# EAGLE schematic tiny-door-and-window-sensor_v03 (EAGLE 7.6.0)
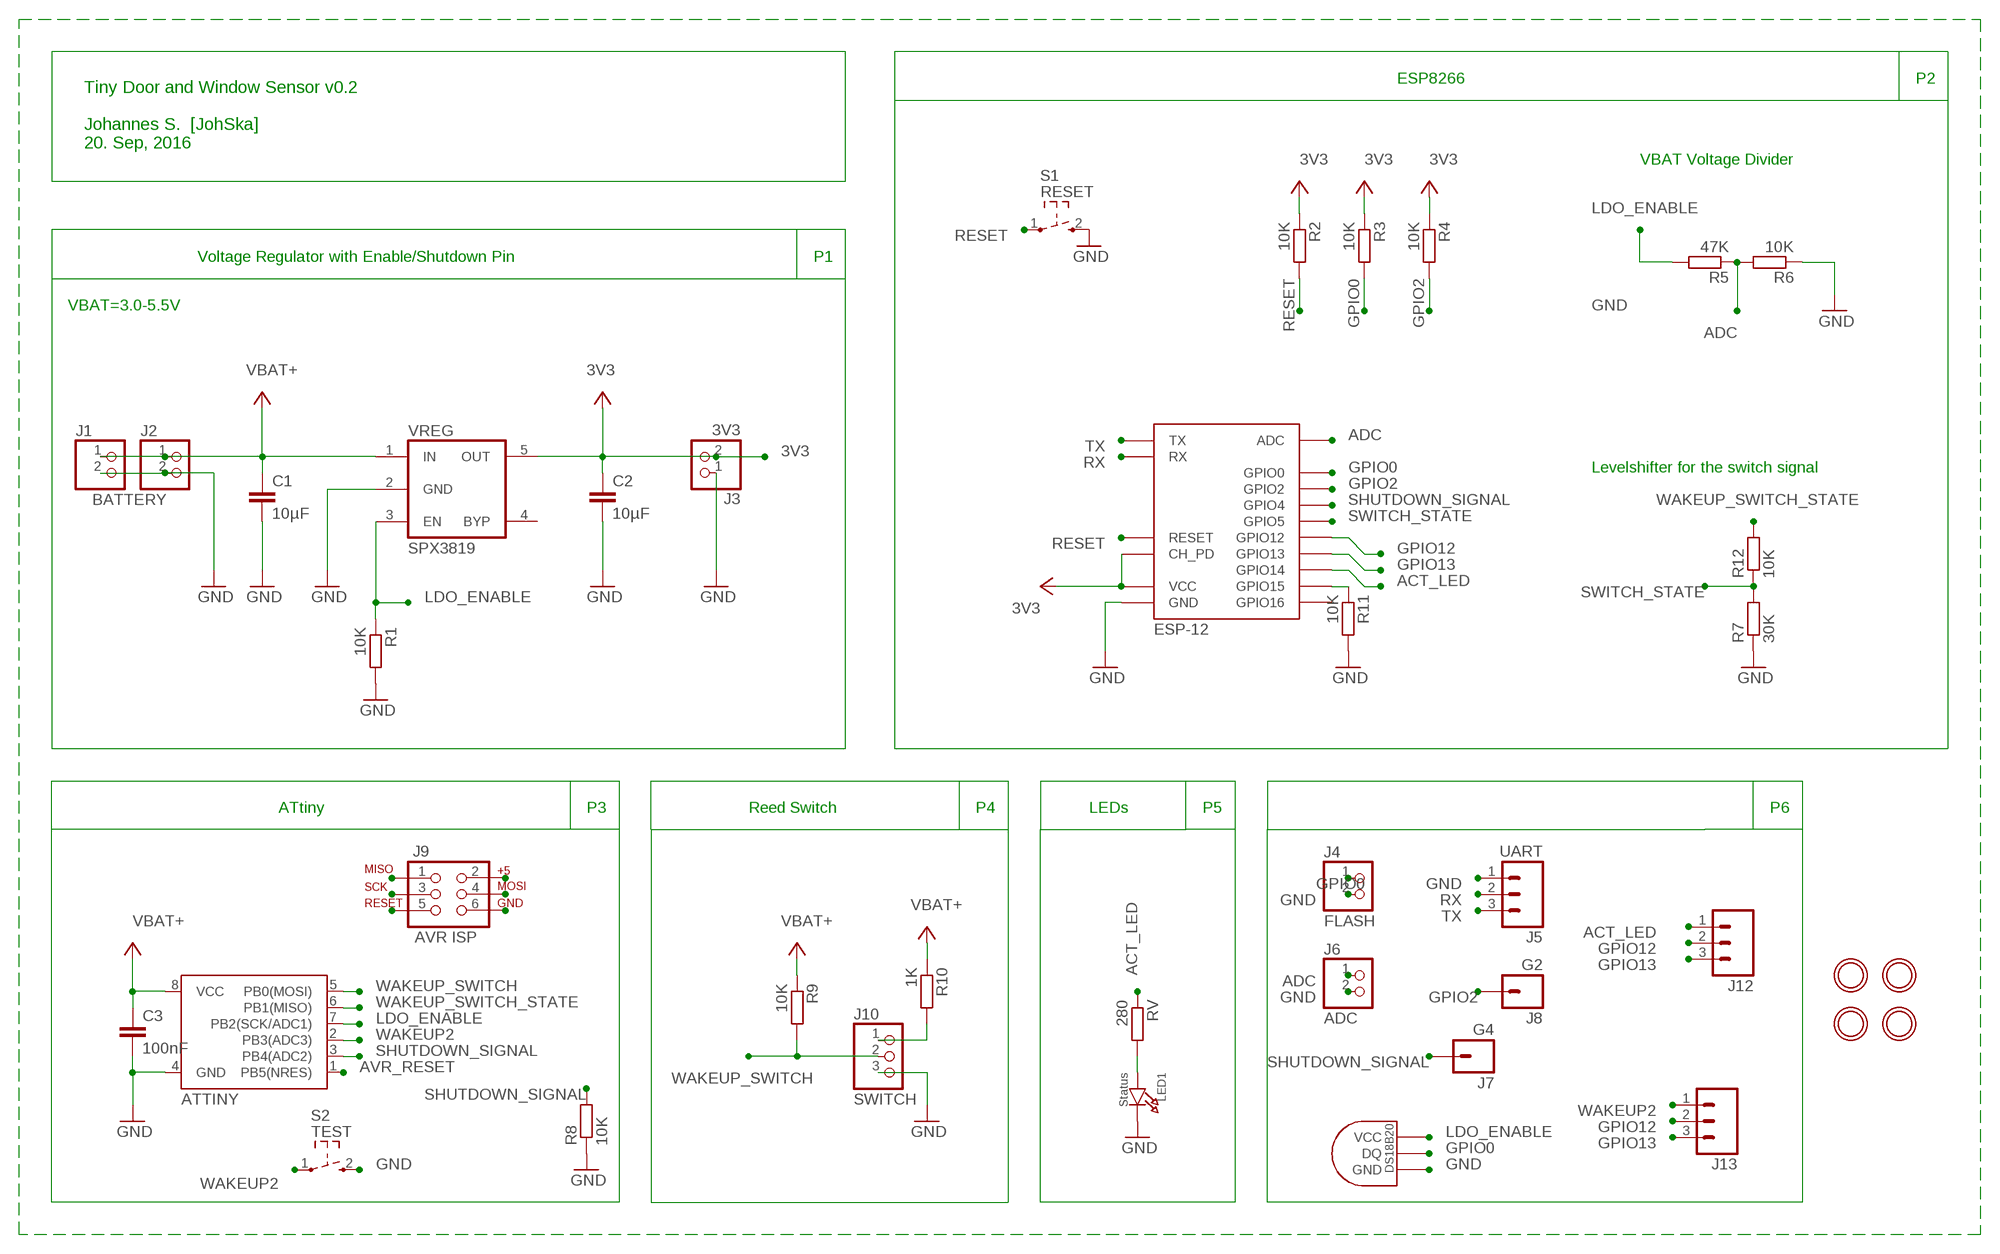
[diagram p0: schematic, sheet 1]

## Parts
C1  10µF  C-EUC0805  [C0805]
C2  10µF  C-EUC0805  [C0805]
C3  100nF  C-EUC0805  [C0805]
J1  BATTERY  HEADER-1X2  [1X02_OVAL]
J2  BATTERY  HEADER-1X2  [1X02_OVAL]
J3  3V3  HEADER-1X2ROUND  [1X02_ROUND]
J4  FLASH  HEADER-1X2ROUND  [1X02_ROUND]
J5  UART  M031X03_NO_SILK  [1X03_NO_SILK]
J6  ADC  HEADER-1X2ROUND  [1X02_ROUND]
J7  G4  M01SMDNS  [1X01NS]
J8  G2  M01SMDNS  [1X01NS]
J9  AVR ISP  AVR_SPI_PRG_6PTH  [2X3]
J10  SWITCH  PINHD-1X3  [1X03]
J12  M031X03_NO_SILK  [1X03_NO_SILK]
J13  M031X03_NO_SILK  [1X03_NO_SILK]
LED1  Status  LED1206  [CHIPLED_1206]
R1  10K  R-EU_R0805  [R0805]
R2  10K  R-EU_R0805  [R0805]
R3  10K  R-EU_R0805  [R0805]
R4  10K  R-EU_R0805  [R0805]
R5  47K  R-EU_R0805  [R0805]
R6  10K  R-EU_R0805  [R0805]
R7  30K  R-EU_R0805  [R0805]
R8  10K  R-EU_R0805  [R0805]
R9  10K  R-EU_R0805  [R0805]
R10  1K  R-EU_R0805  [R0805]
R11  10K  R-EU_R0805  [R0805]
R12  10K  R-EU_R0805  [R0805]
RV  280  R-EU_R0805  [R0805]
S1  RESET  SW_TACT_2P-3X6  [SW_TACT_3X6]
S2  TEST  SW_TACT_2P-3X6  [SW_TACT_3X6]
U$1  DS1820TO92  [DS1820]
U$2  ATTINY  ATTINY45  [SO08-EIAJ]
U$3  ESP-12  [ESP-12]
U$4  MOUNTINGHOLE2.5_THICK  [MOUNTINGHOLE_2.5_PLATED_THICK]
U$5  MOUNTINGHOLE2.5_THICK  [MOUNTINGHOLE_2.5_PLATED_THICK]
U$6  MOUNTINGHOLE2.5_THICK  [MOUNTINGHOLE_2.5_PLATED_THICK]
U$7  MOUNTINGHOLE2.5_THICK  [MOUNTINGHOLE_2.5_PLATED_THICK]
VREG  SPX3819  VREG_5PINS-SOT-23-5  [SOT-23-5]

## Nets
3V3: C2.1 J3.2 R2.1 R3.1 R4.1 U$3.CH_PD U$3.VCC VREG.5(OUT) ; supply symbol labelled VCC
ACT_LED: J12.1 RV.1 U$3.GPIO14
ADC: J6.1 R5.1 R6.2 U$3.ADC
AVR_RESET: J9.5 U$2.1(PB5(NRES))
GND: C1.2 C2.2 C3.2 J1.2 J2.2 J3.1 J4.2 J5.1 J6.2 J9.6 J10.3 LED1.C R1.2 R6.1 R7.1 R8.1 R11.2 S1.2 S2.2 U$1.GND U$2.4(GND) U$3.GND VREG.2(GND)
GPIO0: J4.1 R3.2 U$1.DQ U$3.GPIO0
GPIO2: J8.1 R4.2 U$3.GPIO2
GPIO12: J12.2 J13.2 U$3.GPIO12
GPIO13: J12.3 J13.3 U$3.GPIO13
LDO_ENABLE: J9.3 R1.1 R5.2 U$1.VDD(VCC) U$2.7(PB2(SCK/ADC1)) VREG.3(EN)
N$4: R11.1 U$3.GPIO15
N$8: LED1.A RV.2
RESET: R2.2 S1.1 U$3.RESET
RX: J5.2 U$3.RX
SHUTDOWN_SIGNAL: J7.1 R8.2 U$2.3(PB4(ADC2)) U$3.GPIO4
SWITCH_STATE: R7.2 R12.1 U$3.GPIO5
TX: J5.3 U$3.TX
VBAT+: C1.1 C3.1 J1.1 J2.1 J9.2 R9.1 R10.1 U$2.8(VCC) VREG.1(IN) ; supply symbol labelled VCC
VBAT+_R: J10.1 R10.2
WAKEUP2: J13.1 S2.1 U$2.2(PB3(ADC3))
WAKEUP_SWITCH: J9.4 J10.2 R9.2 U$2.5(PB0(MOSI))
WAKEUP_SWITCH_STATE: J9.1 R12.2 U$2.6(PB1(MISO))
Unconnected: U$3.GPIO16 VREG.4(BYP)

## Notes on the sheet
- ESP8266 | P2
- Tiny Door and Window Sensor v0.2
  
  Johannes S.  [JohSka]
  20. Sep, 2016
- VBAT Voltage Divider
- Voltage Regulator with Enable/Shutdown Pin | P1
- VBAT=3.0-5.5V
- Levelshifter for the switch signal
- ATtiny | P3 | Reed Switch | P4 | LEDs | P5 | P6

## Library data of the parts
C1-C3 = resistor:C-EU: CAPACITOR, European symbol
J1-J4 J6 = microbuilder:HEADER-1X2: PIN HEADER
J5 J12 J13 = SparkFun:M03: Header 3 Standard 3-pin 0.1" header. Use with straight break away headers (SKU : PRT-00116), right angle break away headers (PRT-00553), swiss pins (PRT-00743), machine pins (PRT-00117), and female headers (PRT-00115). Molex polarized connector foot print use with SKU : PRT-08232 with associated crimp pins and housings.
J7 J8 = SparkFun:M01: Header 1 Standard 1-pin 0.1" header. Use with straight break away headers (SKU : PRT-00116), right angle break away headers (PRT-00553), swiss pins (PRT-00743), machine pins (PRT-00117), and female headers (PRT-00115).
J9 = SparkFun:AVR_SPI_PRG_6: AVR ISP 6 Pin This is the reduced ISP connector for AVR programming. Common on Arduino. This footprint will take up less PCB space and can be used with a 10-pin to 6-pin adapter such as SKU: BOB-08508
J10 = pinhead:PINHD-1X3: PIN HEADER
LED1 = microbuilder:LED: LED 0603 - 0603 Surface Mount Package 2mA: Green LED - Low Power (3.9mcd, 2ma, 1.7Vf) - Digikey: 475-2709-2-ND Orange LED - Low Power (9.8mcd, 2ma, 1.8Vf) - Digikey: 475-1194-2-ND Red LED - Low Power (5mcd, 2ma, 1.8Vf) - Digikey: 475-1195-2-ND Yellow LED - Low Power (7mcd, 2ma, 1.8Vf) - Digikey: 475-1196-2-ND 5mA: Blue LED - Low Power (17mcd, 5ma, 2.9Vf) - Digikey: LNJ937W8CRACT-ND 0805 - 0805 Surface Mount Package 2mA: Red LED (8.8mcd, 2mA, 1.8Vf, Clear) - Low Power [Digikey: 475-2510-1-ND] Green LED (5mcd, 2mA, 1.8Vf, Clear) - Low Power [Digikey: 475-2730-1-ND] Yellow LED (11.3mcd, 2mA, 1.8Vf, Clear) - Low Power [Digikey: 475-2555-1-ND] 20mA: Red LED (104mcd, 20mA, Diffused) - LS R976 [Digikey: 475-1278-6-ND] Red LED (12mcd, 20mA, 2.0Vf, Clear) - APT2012EC [Digikey: 754-1128-1-ND] Green LED (15mcd, 20mA, 2.2Vf, Clear) - APT2012GC [Digikey: 754-1131-1-ND] Orange LED (160mcd, 20mA, 2.1Vf, Clear) - APT2012SECK [Digikey: 754-1130-1-ND] 1206 - 1206 Surface Mount Package Green LED (26mcd, 20mA, Diffused) - LG N971 [Digikey: 475-1407-6-ND] Red LED (15mcd, 20mA, Diffused) - LH N974 [Digikey: 475-1416-6-ND]
R1-R12 RV = resistor:R-EU_: RESISTOR, European symbol
S1 S2 = dp-devices:SW_TACT_2P
U$1 = Ava:DS1820: DS18B20 Programmable Resolution 1-Wire Digital Thermometer Description The DS18B20 digital thermometer provides 9-bit to 12-bit Celsius temperature measurements and has an alarm function with nonvolatile user-programmable upper and lower trigger points. The DS18B20 communicates over a 1-Wire® bus that by definition requires only one data line (and ground) for communication with a central microprocessor. It has an operating temperature range of -55°C to +125°C and is accurate to ±0.5°C over the range of -10°C to +85°C. In addition, the DS18B20 can derive power directly from the data line ("parasite power"), eliminating the need for an external power supply. Each DS18B20 has a unique 64-bit serial code, which allows multiple DS18B20s to function on the same 1-Wire bus. Thus, it is simple to use one microprocessor to control many DS18B20s distributed over a large area. Applications that can benefit from this feature include HVAC environmental controls, temperature monitoring systems inside buildings, equipment, or machinery, and process monitoring and control systems.
U$2 = SparkFun:ATTINY45: Atmel ATTiny45
U$3 = johs_esp8266_lib_frank_esp12e_mod:ESP-12: ESP8266 Wifi Module ESP-12; DIMENSIONS: 24.0 x 16.0 mm; PINS: 16; PITCH: 0.078" / 2 mm
U$4-U$7 = microbuilder:MOUNTINGHOLE: Mounting Hole For #2 screws (0.086"/2.18mm width, 0.094"/2.4mm hole) use 2.5mm
VREG = dp-devices:VREG_5PINS: 5 pins voltage regulator